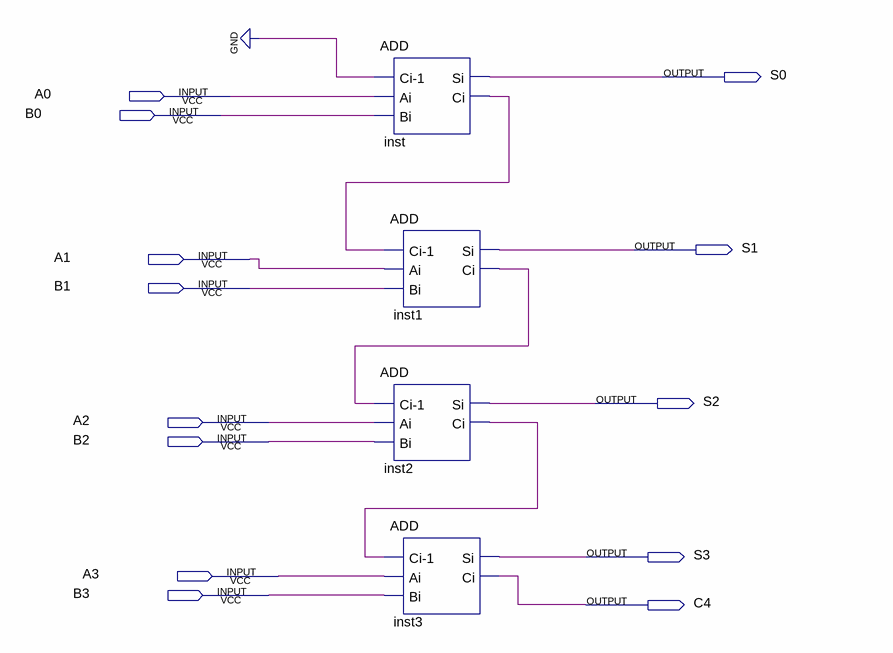
[diagram p0: schematic sheet]
// Quartus schematic ADD1.bdf as structural Verilog: 4 symbols, 13 pins
module ADD1 (
  input  A0,
  input  B0,
  input  A1,
  input  B1,
  input  A2,
  input  B2,
  input  A3,
  input  B3,
  output S0,
  output S1,
  output S2,
  output S3,
  output C4
);

  wire inst1_ci, inst2_ci, inst_ci;

  ADD inst (.\Ci-1 (1'b0), .Ai(A0), .Bi(B0), .Si(S0), .Ci(inst_ci));
  ADD inst2 (.\Ci-1 (inst1_ci), .Ai(A2), .Bi(B2), .Si(S2), .Ci(inst2_ci));
  ADD inst1 (.\Ci-1 (inst_ci), .Ai(A1), .Bi(B1), .Si(S1), .Ci(inst1_ci));
  ADD inst3 (.\Ci-1 (inst2_ci), .Ai(A3), .Bi(B3), .Si(S3), .Ci(C4));
endmodule
